# EAGLE design half-pint-turbidimeter_tsl230rd_tsl267_1.0.1 (EAGLE 7.3.0)
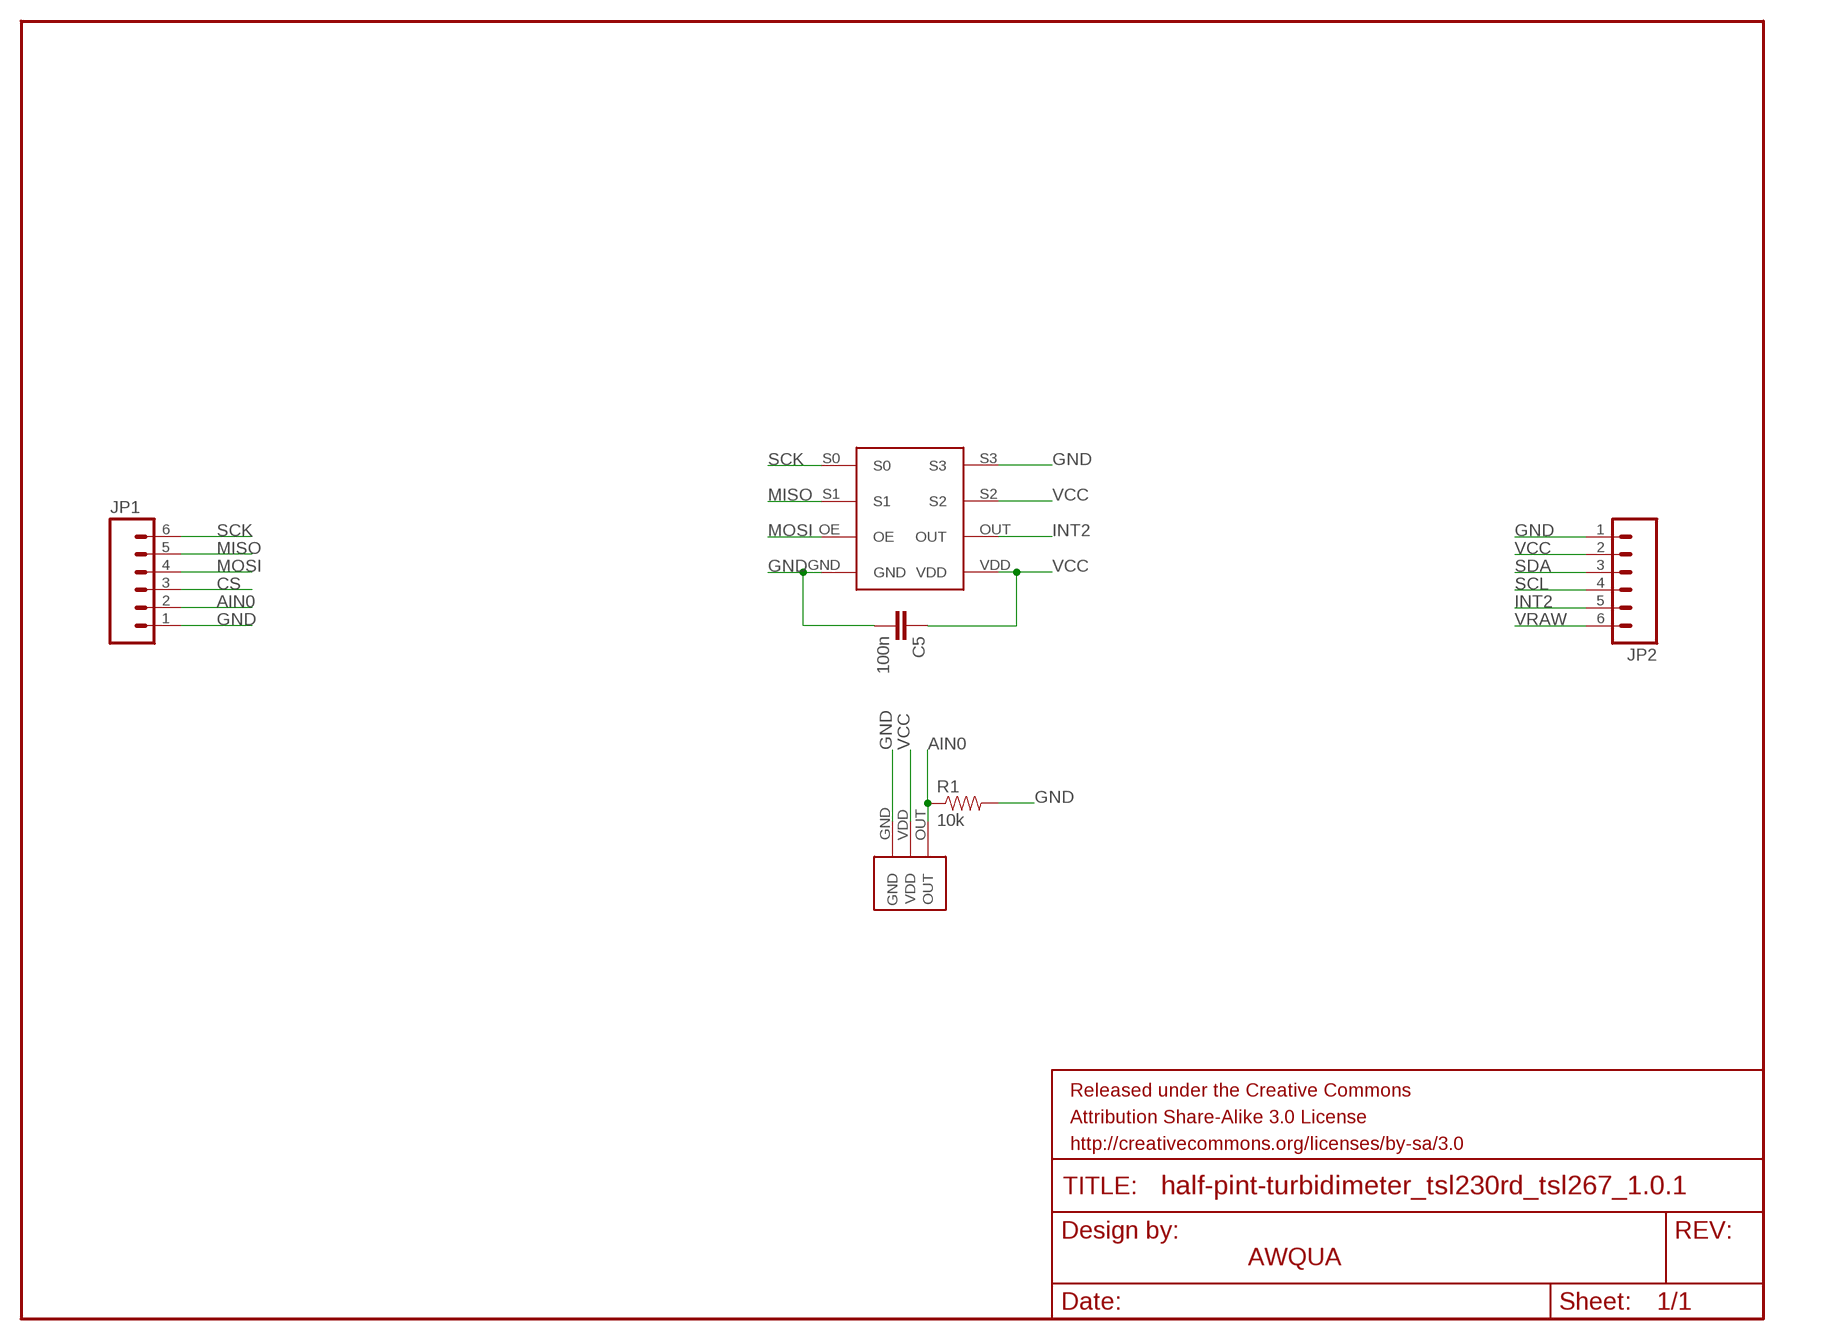
[diagram p0: schematic, sheet 1]

## Parts
C5  100n  CAP0603-CAP  [0603-CAP]
FRAME1  FRAME-LETTER  [CREATIVE_COMMONS]
JP1  M06SIP  [1X06]
JP2  M06SIP  [1X06]
R1  10k  RESISTOR0603-RES  [0603-RES]
U$1  TSL267  [TSL267]
U$6  TSL230RDSMD  [TSL230RD]

## Nets
AIN0: JP1.2 R1.1 U$1.OUT
CS: JP1.3
GND: C5.2 JP1.1 JP2.1 R1.2 U$1.GND U$6.GND U$6.S3
INT2: JP2.5 U$6.OUT
MISO: JP1.5 U$6.S1
MOSI: JP1.4 U$6.OE
SCK: JP1.6 U$6.S0
SCL: JP2.4
SDA: JP2.3
VCC: C5.1 JP2.2 U$1.VDD U$6.S2 U$6.VDD
VRAW: JP2.6

## Notes on the sheet
- AWQUA

## Library data of the parts
C5 = SparkFun:CAP: Capacitor Standard 0603 ceramic capacitor, and 0.1" leaded capacitor.
FRAME1 = SparkFun-Aesthetics:FRAME-LETTER: Schematic Frame Standard 8.5x11 US Letter frame
JP1 JP2 = SparkFun-Connectors:M06: Header 6 Standard 6-pin 0.1" header. Use with straight break away headers (SKU : PRT-00116), right angle break away headers (PRT-00553), swiss pins (PRT-00743), machine pins (PRT-00117), and female headers (PRT-00115). Molex polarized connector foot print use with SKU : PRT-08094 with associated crimp pins and housings. NOTES ON THE VARIANTS LOCK and LOCK_LONGPADS... This footprint was designed to help hold the alignment of a through-hole component (i.e. 6-pin header) while soldering it into place. You may notice that each hole has been shifted either up or down by 0.005 of an inch from it's more standard position (which is a perfectly straight line). This slight alteration caused the pins (the squares in the middle) to touch the edges of the holes. Because they are alternating, it causes a "brace" to hold the component in place. 0.005 has proven to be the perfect amount of "off-center" position when using our standard breakaway headers. Although looks a little odd when you look at the bare footprint, once you have a header in there, the alteration is very hard to notice. Also,if you push a header all the way into place, it is covered up entirely on the bottom side. This idea of altering the position of holes to aid alignment will be further integrated into the Sparkfun Library for other footprints. It can help hold any component with 3 or more connection pins.
R1 = SparkFun-Passives:RESISTOR: Resistor Basic schematic elements and footprints for 0603, 1206, and PTH resistors.
U$1 = awqua_eagle_library:TSL267
U$6 = awqua_eagle_library:TSL230RD

## Board
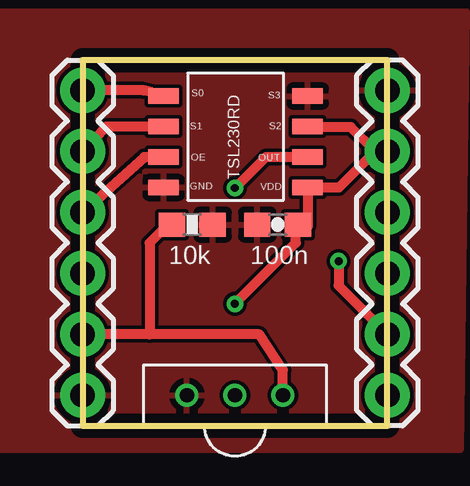
[diagram p1: board, top side]
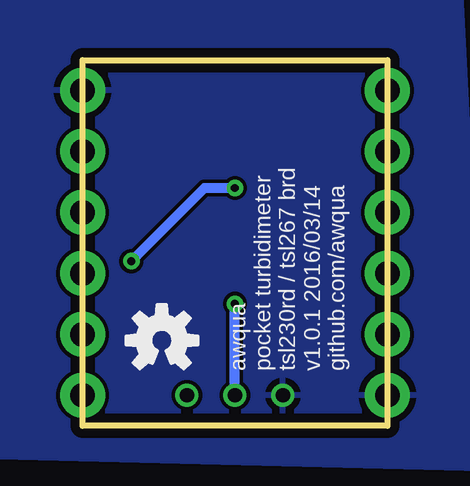
[diagram p2: board, bottom side, seen from below]

Size 12.7 x 15.24 mm. Coordinates in mm from the lower left corner, seen from the top.
Outline: 0,0 12.7,0 12.7,15.24 0,15.24 0,0
Copper layers (1*16): Top 0.0356mm / dielectric 1.5011mm / Bottom 0.0356mm
Design rules "default *": minimum track width 6mil, minimum drill 13mil, track to track 6mil, track to pad 6mil, pad to pad 6mil, via to via 6mil, smd to smd 6mil, copper to edge 15mil, drill to drill 6mil, minimum pad ring 7mil, minimum via ring 7mil, stop-mask expansion 4mil, vias tented up to drill 15mil, thermal gap 10mil

### Footprints (pad centres in the part's own frame; a part is rotated, then mirrored left to right if it is on the bottom)
0603-CAP = smd 1.1 x 1: 1 -0.85,0; 2 0.85,0
1X06 = drill 1.016 pad 1.88: 1 0,0; 2 2.54,0; 3 5.08,0; 4 7.62,0; 5 10.16,0; 6 12.7,0
0603-RES = smd 1.1 x 1: 1 -0.85,0; 2 0.85,0
TSL267 = drill 0.6 pad 0.9: GND -2,0; OUT 2,0; VDD 0,0
TSL230RD = smd 0.635 x 1.27: GND 0.53,5; OE 1.8,5; OUT 1.8,-1; S0 4.34,5; S1 3.07,5; S2 3.07,-1; S3 4.34,-1; VDD 0.53,-1

### Placement (x,y rotation side)
C5  8.13,8.38 180 top
FRAME1  19.68,-7.62 0 top  (outside the outline)
JP1  0,1.27 90 top
JP2  12.7,13.97 270 top
R1  4.57,8.38 0 top
U$1  6.35,1.27 0 top
U$5  [OSHW-LOGO-S]  9.4,3.56 0 bottom
U$6  8.38,9.4 90 top

### Tracks (layer width: path | path; a pad name or v marks a point on that pad's centre or on a via)
AIN0
  Top 0.406: R1.1 3.56,8.38 2.79,7.62 2.79,3.81 | 2.79,3.81 JP1.2 | U$1.OUT 8.35,2.32 7.37,3.81 2.79,3.81
GND
  pour Top: -4.06,17.27 16,17.27 15.75,-1.02 -4.32,-1.02
  pour Bottom: -3.05,18.03 16.76,18.29 16.26,-1.27 -4.06,-1.78
INT2  (via drill 0.33)
  Top 0.406: U$6.OUT 7.64,11.2 v6.35,9.91 | v10.67,6.86 10.67,5.84 JP2.5
  Bottom 0.406: v6.35,9.91 7.62,9.91 v10.67,6.86
MISO
  Top 0.406: U$6.S1 0.99,12.47 JP1.5
MOSI
  Top 0.406: U$6.OE 2.56,11.2 JP1.4
SCK
  Top 0.406: U$6.S0 2.87,13.89 2.54,13.97 JP1.6
VCC  (via drill 0.33)
  Top 0.406: JP2.2 12.19,11.43 | 12.19,11.43 11.18,12.45 9.91,12.45 U$6.S2 | 12.19,11.43 10.69,9.93 U$6.VDD 9.38,8.28 C5.1 8.89,8.29 8.89,7.62 v6.35,5.08
  Bottom 0.406: U$1.VDD v6.35,5.08

### Text on the board
bNames: awqua / pocket turbidimeter / tsl230rd / tsl267 brd / v1.0.1 2016/03/14 / github.com/awqua